# Altium schematic sheet Sheet1.SchDoc
size A4; SheetNumber: 1; SheetTotal: 1
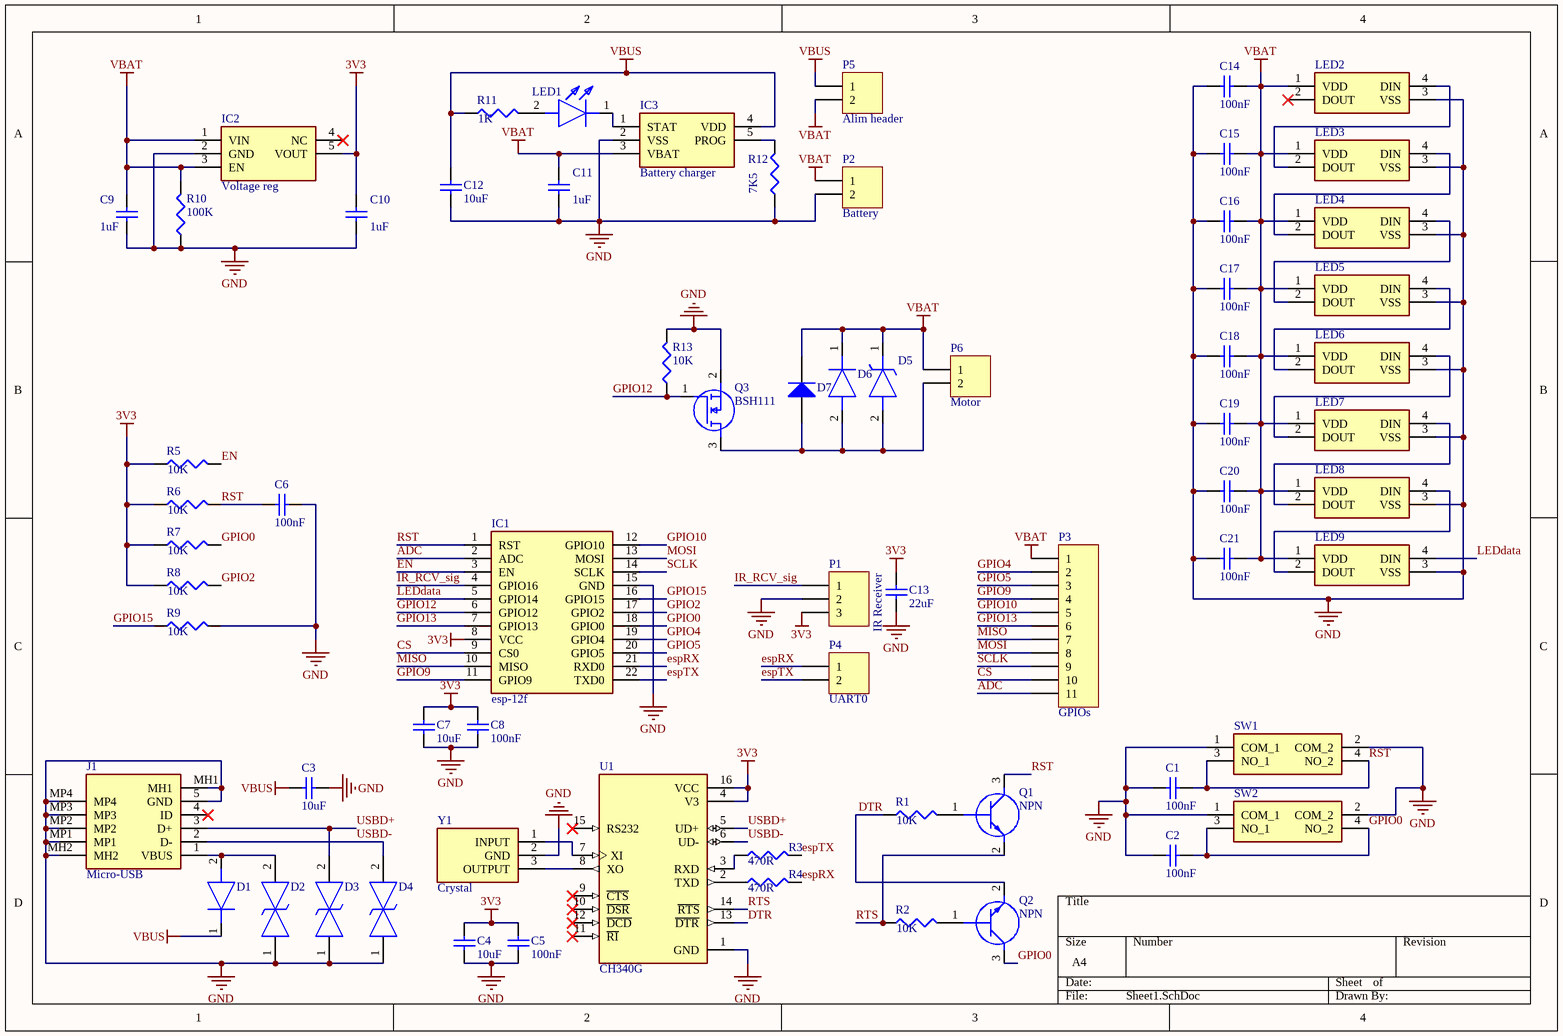
[diagram p0: Sheet1.SchDoc]

## Parts
C1  value 100nF  [1608[0603]]  (hidden comment: Cap Semi)
C2  value 100nF  [1608[0603]]  (hidden comment: Cap Semi)
C3  value 10uF  [1608[0603]]  (hidden comment: Cap Semi)
C4  value 10uF  [1608[0603]]  (hidden comment: Cap Semi)
C5  value 100nF  [1608[0603]]  (hidden comment: Cap Semi)
C6  value 100nF  [1608[0603]]  (hidden comment: Cap Semi)
C7  value 10uF  [1608[0603]]  (hidden comment: Cap Semi)
C8  value 100nF  [1608[0603]]  (hidden comment: Cap Semi)
C9  value 1uF  [1608[0603]]  (hidden comment: Cap Semi)
C10  value 1uF  [1608[0603]]  (hidden comment: Cap Semi)
C11  value 1uF  [1608[0603]]  (hidden comment: Cap Semi)
C12  value 10uF  [1608[0603]]  (hidden comment: Cap Semi)
C13  value 22uF  [1608[0603]]  (hidden comment: Cap Semi)
C14  value 100nF  [1608[0603]]  (hidden comment: Cap Semi)
C15  value 100nF  [1608[0603]]  (hidden comment: Cap Semi)
C16  value 100nF  [1608[0603]]  (hidden comment: Cap Semi)
C17  value 100nF  [1608[0603]]  (hidden comment: Cap Semi)
C18  value 100nF  [1608[0603]]  (hidden comment: Cap Semi)
C19  value 100nF  [1608[0603]]  (hidden comment: Cap Semi)
C20  value 100nF  [1608[0603]]  (hidden comment: Cap Semi)
C21  value 100nF  [1608[0603]]  (hidden comment: Cap Semi)
D1  1N5819HW-7-F  [SOD3716X145N]  (value not drawn)
D2  DF2B6M4CT,L3F  [DF2B6M4CTL3F]  (value not drawn)
D3  DF2B6M4CT,L3F  [DF2B6M4CTL3F]  (value not drawn)
D4  DF2B6M4CT,L3F  [DF2B6M4CTL3F]  (value not drawn)
D5  BZY55C30_RBG  [DIOC2012X85N]  (value not drawn)
D6  PESD0603-240  [DIONC1608X55N]  (value not drawn)
D7  Diode 1N914  [DO-35]  (value not drawn)
IC1  esp-12f  [esp12f]
IC2  Voltage reg  [SOT94P279X130-5N]
IC3  Battery charger  [SOT95P270X145-5N]
J1  Micro-USB  [1051640001]
LED1  150060GS55040  [LEDC1608X50N]  (value not drawn)
LED2  COM-13667  [COM13667]  (value not drawn)
LED3  COM-13667  [COM13667]  (value not drawn)
LED4  COM-13667  [COM13667]  (value not drawn)
LED5  COM-13667  [COM13667]  (value not drawn)
LED6  COM-13667  [COM13667]  (value not drawn)
LED7  COM-13667  [COM13667]  (value not drawn)
LED8  COM-13667  [COM13667]  (value not drawn)
LED9  COM-13667  [COM13667]  (value not drawn)
P1  IR Receiver  [HDR1X3]
P2  Battery  [HDR1X2]
P3  GPIOs  [HDR1X11]
P4  UART0  [HDR1X2]
P5  Alim header  [HDR1X2]
P6  Motor  [HDR1X2]
Q1  NPN  [SOT95P230X110-3N]
Q2  NPN  [SOT95P230X110-3N]
Q3  BSH111  [SOT95P230X100-3N]
R1  value 10K  [J1-0603]  (hidden comment: Res3)
R2  value 10K  [J1-0603]  (hidden comment: Res3)
R3  value 470R  [J1-0603]  (hidden comment: Res3)
R4  value 470R  [J1-0603]  (hidden comment: Res3)
R5  value 10K  [J1-0603]  (hidden comment: Res3)
R6  value 10K  [J1-0603]  (hidden comment: Res3)
R7  value 10K  [J1-0603]  (hidden comment: Res3)
R8  value 10K  [J1-0603]  (hidden comment: Res3)
R9  value 10K  [J1-0603]  (hidden comment: Res3)
R10  value 100K  [J1-0603]  (hidden comment: Res3)
R11  value 1K  [J1-0603]  (hidden comment: Res3)
R12  value 7K5  [J1-0603]  (hidden comment: Res3)
R13  value 10K  [J1-0603]  (hidden comment: Res3)
SW1  PTS526_SM15_SMTR2_LFS  [PTS526SM15SMTR2LFS]  (value not drawn)
SW2  PTS526_SM15_SMTR2_LFS  [PTS526SM15SMTR2LFS]  (value not drawn)
U1  CH340G  [SOIC127P600X180-16N]
Y1  Crystal  [CSTCE12M0G55R0]

## Nets
3V3: C4.1 C5.1 C7.1 C8.1 C10.1 C13.1 IC1.8(VCC) IC2.5(VOUT) P1.3 R5.1 R6.1 R7.1 R8.1 U1.4(V3) U1.16(VCC)
GND: C1.2 C2.2 C3.1 C4.2 C5.2 C6.2 C7.2 C8.2 C9.2 C10.2 C11.2 C12.2 C13.2 C14.1 C15.1 C16.1 C17.1 C18.1 C19.1 C20.1 C21.1 D2.1 D3.1 D4.1 IC1.15(GND) IC2.2(GND) IC3.2(VSS) J1.5(GND) J1.MH1 J1.MH2 J1.MP1 J1.MP2 J1.MP3 J1.MP4 LED2.3(VSS) LED3.3(VSS) LED4.3(VSS) LED5.3(VSS) LED6.3(VSS) LED7.3(VSS) LED8.3(VSS) LED9.3(VSS) P1.2 P2.2 Q3.2(S) R9.2 R10.1 R12.1 R13.1 SW1.1(COM_1) SW1.2(COM_2) SW2.1(COM_1) SW2.2(COM_2) U1.1(GND) Y1.2(GND)
VBAT: C9.1 C11.1 C14.2 C15.2 C16.2 C17.2 C18.2 C19.2 C20.2 C21.2 D5.1(K) D6.1(K) D7.2(K) IC2.1(VIN) IC2.3(EN) IC3.3(VBAT) LED2.1(VDD) LED3.1(VDD) LED4.1(VDD) LED5.1(VDD) LED6.1(VDD) LED7.1(VDD) LED8.1(VDD) LED9.1(VDD) P2.1 P3.1 P5.2 P6.1 R10.2
VBUS: C3.2 C12.1 D1.1(K) IC3.4(VDD) P5.1 R11.1
ADC: IC1.2(ADC) P3.11
CS: IC1.9(CS0) P3.10
DTR: Q2.2(E) R1.1 U1.13(~{DTR})
EN: IC1.3(EN) R5.2
espRX: IC1.21(RXD0) P4.1 R4.2
espTX: IC1.22(TXD0) P4.2 R3.2
GPIO0: C2.1 IC1.18(GPIO0) Q2.3(C) R7.2 SW2.3(NO_1) SW2.4(NO_2)
GPIO2: IC1.17(GPIO2) R8.2
GPIO4: IC1.19(GPIO4) P3.2
GPIO5: IC1.20(GPIO5) P3.3
GPIO9: IC1.11(GPIO9) P3.4
GPIO10: IC1.12(GPIO10) P3.5
GPIO12: IC1.6(GPIO12) Q3.1(G) R13.2
GPIO13: IC1.7(GPIO13) P3.6
GPIO15: IC1.16(GPIO15) R9.1
IR_RCV_sig: IC1.4(GPIO16) P1.1
LEDdata: IC1.5(GPIO14) LED9.4(DIN)
MISO: IC1.10(MISO) P3.7
MOSI: IC1.13(MOSI) P3.8
RST: C1.1 C6.1 IC1.1(RST) Q1.3(C) R6.2 SW1.3(NO_1) SW1.4(NO_2)
RTS: Q1.2(E) R2.1 U1.14(~{RTS})
SCLK: IC1.14(SCLK) P3.9
USBD+: D3.2 J1.3(D+) U1.5(UD+)
USBD-: D4.2 J1.2(D-) U1.6(UD-)
NetD1_2: D1.2(A) D2.2 J1.1(VBUS)
NetD5_2: D5.2(A) D6.2(A) D7.1(A) P6.2 Q3.3(D)
NetIC3_1: IC3.1(STAT) LED1.1(K)
NetIC3_5: IC3.5(PROG) R12.2
NetLED1_2: LED1.2(A) R11.2
NetLED2_4: LED2.4(DIN) LED3.2(DOUT)
NetLED3_4: LED3.4(DIN) LED4.2(DOUT)
NetLED4_4: LED4.4(DIN) LED5.2(DOUT)
NetLED5_4: LED5.4(DIN) LED6.2(DOUT)
NetLED6_4: LED6.4(DIN) LED7.2(DOUT)
NetLED7_4: LED7.4(DIN) LED8.2(DOUT)
NetLED8_4: LED8.4(DIN) LED9.2(DOUT)
NetQ1_1: Q1.1(B) R1.2
NetQ2_1: Q2.1(B) R2.2
NetR3_1: R3.1 U1.3(RXD)
NetR4_1: R4.1 U1.2(TXD)
NetU1_7: U1.7(XI) Y1.1(INPUT)
NetU1_8: U1.8(XO) Y1.3(OUTPUT)

Not connected (* = marked no-connect by the designer): IC2 4(NC)*; J1 4(ID)*; LED2 2(DOUT)*; U1 9(~{CTS})* 10(~{DSR})* 11(~{RI})* 12(~{DCD})* 15(RS232)*

## Library data of the parts
C1-C21 = Cap Semi: Capacitor (Semiconductor SIM Model); Published: 8-Jun-2000; LatestRevisionDate: 29-May-2009; LatestRevisionNote: IPC-7351 Footprint Added.; PackageReference: C1206; Publisher: Altium Limited; PackageDescription: Chip Capacitor
D1 = 1N5819HW-7-F: Diode; Manufacturer_Name: Diodes Inc.; Datasheet Link: https://datasheet.datasheetarchive.com/originals/distributors/Datasheets-DGA23/1390892.pdf; Height: 1.45mm; Manufacturer_Part_Number: 1N5819HW-7-F; Mouser Part Number: 621-1N5819HW-F; Mouser Price/Stock: https://www.mouser.co.uk/ProductDetail/Diodes-Incorporated/1N5819HW-7-F?qs=NQ47qNm99eDyWTEd07miYA%3D%3D; Arrow Part Number: 1N5819HW-7-F; Arrow Price/Stock: https://www.arrow.com/en/products/1n5819hw-7-f/diodes-incorporated?region=europe
D2-D4 = DF2B6M4CT,L3F: TVS Diode (Bi-directional); Manufacturer_Name: Toshiba; Datasheet Link: https://static6.arrow.com/aropdfconversion/35aad045143cfbe56d4c3115b403a38cdd93b55b/3docget.jspdid55771prodnamedf2b6m4ct.jspdid55771prodnamedf2b6m4ct..pdf; Height: 0.4mm; Manufacturer_Part_Number: DF2B6M4CT,L3F; Mouser Part Number: 757-DF2B6M4CTL3F; Mouser Price/Stock: https://www.mouser.co.uk/ProductDetail/Toshiba/DF2B6M4CTL3F/?qs=HXFqYaX1Q2xAOjv9GW6UtQ%3D%3D; Arrow Part Number: DF2B6M4CT,L3F; Arrow Price/Stock: https://www.arrow.com/en/products/df2b6m4ctl3f/toshiba
D5 = BZY55C30_RBG: Zener Diode; Manufacturer_Name: Taiwan Semiconductor; Manufacturer_Part_Number: BZY55C30 RBG; Datasheet Link: https://www.mouser.com/datasheet/2/395/BZY55C2V4_SERIES_D1612-1918069.pdf; Height: 0.85mm; Mouser Part Number: 821-BZY55C30RBG; Mouser Price/Stock: https://www.mouser.co.uk/ProductDetail/Taiwan-Semiconductor/BZY55C30-RBG?qs=mAH9sUMRCtsR47hR59kl1g%3D%3D
D6 = PESD0603-240: Diode; Manufacturer_Name: LITTELFUSE; Datasheet Link: http://www.littelfuse.com/~/media/electronics/datasheets/polymer_esd_suppressors/littelfuse_polymer_esd_suppressor_pesd_catalog_datasheet.pdf.pdf; Height: 0.55mm; Manufacturer_Part_Number: PESD0603-240; Mouser Part Number: 650-PESD0603-240; Mouser Price/Stock: https://www.mouser.co.uk/ProductDetail/Littelfuse/PESD0603-240?qs=NK6InXoXhq6AnVVWZjdyfg%3D%3D; Arrow Part Number: PESD0603-240; Arrow Price/Stock: https://www.arrow.com/en/products/pesd0603-240/littelfuse?region=nac
D7 = Diode 1N914: High Conductance Fast Diode; Published: 8-Jun-2000; LatestRevisionDate: 17-Jul-2002; LatestRevisionNote: Re-released for DXP Platform.; DatasheetVersion: 1997; PackageReference: DO-35; Publisher: Altium Limited; PackageDescription: Diode, Axial; Body 3.8 x 1.9 mm (LxDia. max), Lead Dia. 0.53 mm (max); Code_JEDEC: DO-204-AH; ComponentLink1Description: Manufacturer Link; ComponentLink1URL: http://www.fairchildsemi.com/; ComponentLink2Description: Datasheet; ComponentLink2URL: http://www.fairchildsemi.com/ds/1N%2F1N4448.pdf
IC1 = esp-12f: Integrated Circuit; Manufacturer_Name: Ai-Thinker; Datasheet Link: https://docs.ai-thinker.com/_media/esp8266/docs/esp-12f_product_specification_en.pdf; Height: 3.1mm; Manufacturer_Part_Number: esp-12f
IC2 = RT9013-12PB: Integrated Circuit; Manufacturer_Name: RICHTEK; Datasheet Link: https://www.digchip.com/datasheets/parts/datasheet/403/RT9013-12PB-pdf.php; Height: 1.295mm; Manufacturer_Part_Number: RT9013-12PB
IC3 = MCP73831T-2ACI_OT: Integrated Circuit; Manufacturer_Name: Microchip; Manufacturer_Part_Number: MCP73831T-2ACI/OT; Datasheet Link: http://ww1.microchip.com/downloads/en/DeviceDoc/20001984g.pdf; Height: 1.45mm; Mouser Part Number: 579-MCP73831T-2ACIOT; Mouser Price/Stock: https://www.mouser.co.uk/ProductDetail/Microchip-Technology/MCP73831T-2ACI-OT?qs=yUQqVecv4qvbBQBGbHx0Mw%3D%3D; Arrow Part Number: MCP73831T-2ACI/OT; Arrow Price/Stock: https://www.arrow.com/en/products/mcp73831t-2aciot/microchip-technology?region=nac
J1 = 105164-0001: Connector; pin to pad: 1>5 2>4 4>2 5>1; Manufacturer_Name: Molex; Datasheet Link: https://www.molex.com/pdm_docs/sd/1051640001_sd.pdf; Height: 2.7mm; Manufacturer_Part_Number: 105164-0001; Mouser Part Number: 538-105164-0001; Mouser Price/Stock: https://www.mouser.co.uk/ProductDetail/Molex/105164-0001?qs=JAwGc6FMfvtRY4SkW%2FoGcQ%3D%3D
LED1 = 150060GS55040: LED; Manufacturer_Name: Wurth Elektronik; Datasheet Link: https://katalog.we-online.de/led/datasheet/150060GS55040.pdf; Height: 0.5mm; Manufacturer_Part_Number: 150060GS55040; Mouser Part Number: 710-150060GS55040; Mouser Price/Stock: https://www.mouser.co.uk/ProductDetail/Wurth-Elektronik/150060GS55040?qs=fAHHVMwC%252Bbhr5Aln2oA6Nw%3D%3D
LED2-LED9 = COM-13667: LED; Manufacturer_Name: SparkFun; Datasheet Link: https://cdn.sparkfun.com/datasheets/BreakoutBoards/WS2812B.pdf; Height: 2mm; Manufacturer_Part_Number: COM-13667; Mouser Part Number: 474-COM-13667; Mouser Price/Stock: https://www.mouser.co.uk/ProductDetail/SparkFun/COM-13667?qs=WyAARYrbSnYuV74MbwnFXg%3D%3D; Arrow Part Number: COM-13667; Arrow Price/Stock: https://www.arrow.com/en/products/com-13667/sparkfun-electronics?region=nac
P1 = Header 3: Header, 3-Pin; LatestRevisionDate: 17-Jul-2002; LatestRevisionNote: Re-released for DXP Platform.; Publisher: Altium Limited
P2 P5 P6 = Header 2: Header, 2-Pin; LatestRevisionDate: 17-Jul-2002; LatestRevisionNote: Re-released for DXP Platform.; Publisher: Altium Limited
P3 = Header 11: Header, 11-Pin; LatestRevisionDate: 17-Jul-2002; LatestRevisionNote: Re-released for DXP Platform.; Publisher: Altium Limited
P4 = Header 2: LatestRevisionDate: 17-Jul-2002; LatestRevisionNote: Re-released for DXP Platform.; Publisher: Altium Limited
Q1 Q2 = BCW66FR: Transistor BJT NPN; Manufacturer_Name: Nexperia; Datasheet Link: https://www.mouser.in/datasheet/2/916/BCW66X_SER-1319560.pdf; Height: 1.1mm; Manufacturer_Part_Number: BCW66FR; Mouser Part Number: 771-BCW66FR; Mouser Price/Stock: https://www.mouser.co.uk/ProductDetail/Nexperia/BCW66FR?qs=vLWxofP3U2xgYVmJT%2Fr4qw%3D%3D; Arrow Part Number: BCW66FR; Arrow Price/Stock: https://www.arrow.com/en/products/bcw66fr/nexperia?region=europe
Q3 = PMV15ENER: MOSFET (N-Channel); Manufacturer_Name: Nexperia; Datasheet Link: https://assets.nexperia.com/documents/data-sheet/PMV15ENE.pdf; Height: 1mm; Manufacturer_Part_Number: PMV15ENER; Mouser Part Number: 771-PMV15ENER; Mouser Price/Stock: https://www.mouser.co.uk/ProductDetail/Nexperia/PMV15ENER?qs=Li%252BoUPsLEntpTHKsialBmQ%3D%3D
R1-R13 = Res3: Resistor; Published: 8-Jun-2000; LatestRevisionDate: 29-May-2009; LatestRevisionNote: IPC-7351 Footprint Added.; PackageReference: J1-0603; Publisher: Altium Limited; PackageDescription: Chip Resistor
SW1 SW2 = PTS526_SM15_SMTR2_LFS: Switch; Manufacturer_Name: C & K COMPONENTS; Manufacturer_Part_Number: PTS526 SM15 SMTR2 LFS; Datasheet Link: https://www.mouser.com/datasheet/2/60/pts526-1651200.pdf; Height: 1.5mm; Mouser Part Number: 611-PTS526SM15SMTR2L; Mouser Price/Stock: https://www.mouser.co.uk/ProductDetail/CK/PTS526-SM15-SMTR2-LFS?qs=UXgszm6BlbENivbslIA%252B5g%3D%3D; Arrow Part Number: PTS526 SM15 SMTR2 LFS; Arrow Price/Stock: https://www.arrow.com/en/products/pts526-sm15-smtr2-lfs/ck?region=nac
U1 = CH340G: USB Interface Integrated Circuit; MF: WCH; Value: *; SnapEDA_Link: https://www.snapeda.com/parts/Ch340G/WCH/view-part/?ref=snap; MP: Ch340G; Check_prices: https://www.snapeda.com/parts/Ch340G/WCH/view-part/?ref=eda; Availability: Not in stock; Price: None; Package: None
Y1 = CSTCE12M0G55-R0: Crystal or Oscillator; Manufacturer_Name: Murata Electronics; Datasheet Link: http://uk.rs-online.com/web/p/products/7214809; Height: 0.8mm; Manufacturer_Part_Number: CSTCE12M0G55-R0; Mouser Part Number: 81-CSTCE12M0G55-R0; Mouser Price/Stock: https://www.mouser.co.uk/ProductDetail/Murata-Electronics/CSTCE12M0G55-R0?qs=X%252BGJbDQiXeURAOWF7GvM7A%3D%3D